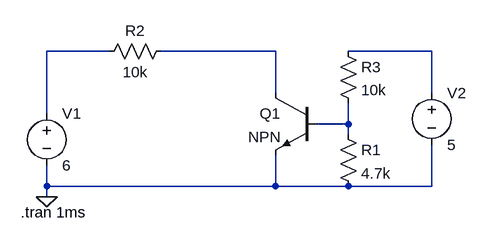
[diagram p0: schematic motor-switch.asc]
motor-switch.asc, the LTspice schematic file:
Version 4
SHEET 1 888 680
WIRE 144 16 48 16
WIRE 400 16 224 16
WIRE 640 16 512 16
WIRE 400 80 400 16
WIRE 640 80 640 16
WIRE 48 112 48 16
WIRE 512 128 512 96
WIRE 512 128 464 128
WIRE 512 144 512 128
WIRE 48 224 48 192
WIRE 400 224 400 176
WIRE 400 224 48 224
WIRE 512 224 400 224
WIRE 640 224 640 160
WIRE 640 224 512 224
WIRE 48 240 48 224
FLAG 48 240 0
SYMBOL voltage 48 96 R0
WINDOW 123 0 0 Left 0
WINDOW 39 0 0 Left 0
SYMATTR InstName V1
SYMATTR Value 6
SYMBOL voltage 640 64 R0
WINDOW 123 0 0 Left 0
WINDOW 39 0 0 Left 0
SYMATTR InstName V2
SYMATTR Value 5
SYMBOL npn 464 80 M0
SYMATTR InstName Q1
SYMBOL res 496 128 R0
SYMATTR InstName R1
SYMATTR Value 4.7k
SYMBOL res 240 0 R90
WINDOW 0 0 56 VBottom 2
WINDOW 3 32 56 VTop 2
SYMATTR InstName R2
SYMATTR Value 10k
SYMBOL res 496 0 R0
SYMATTR InstName R3
SYMATTR Value 10k
TEXT 8 264 Left 2 !.tran 1ms

The netlist it stands for:
* motor-switch.asc
V1 N001 0 6
V2 N003 0 5
Q1 N002 N004 0 0 NPN
R1 N004 0 4.7k
R2 N002 N001 10k
R3 N003 N004 10k
.model NPN NPN
.model PNP PNP
.lib standard.bjt
.tran 1ms
.backanno
.end